# Altium schematic sheet Power.SchDoc
size 420 x 297 mm; SheetNumber: 1; SheetTotal: 3
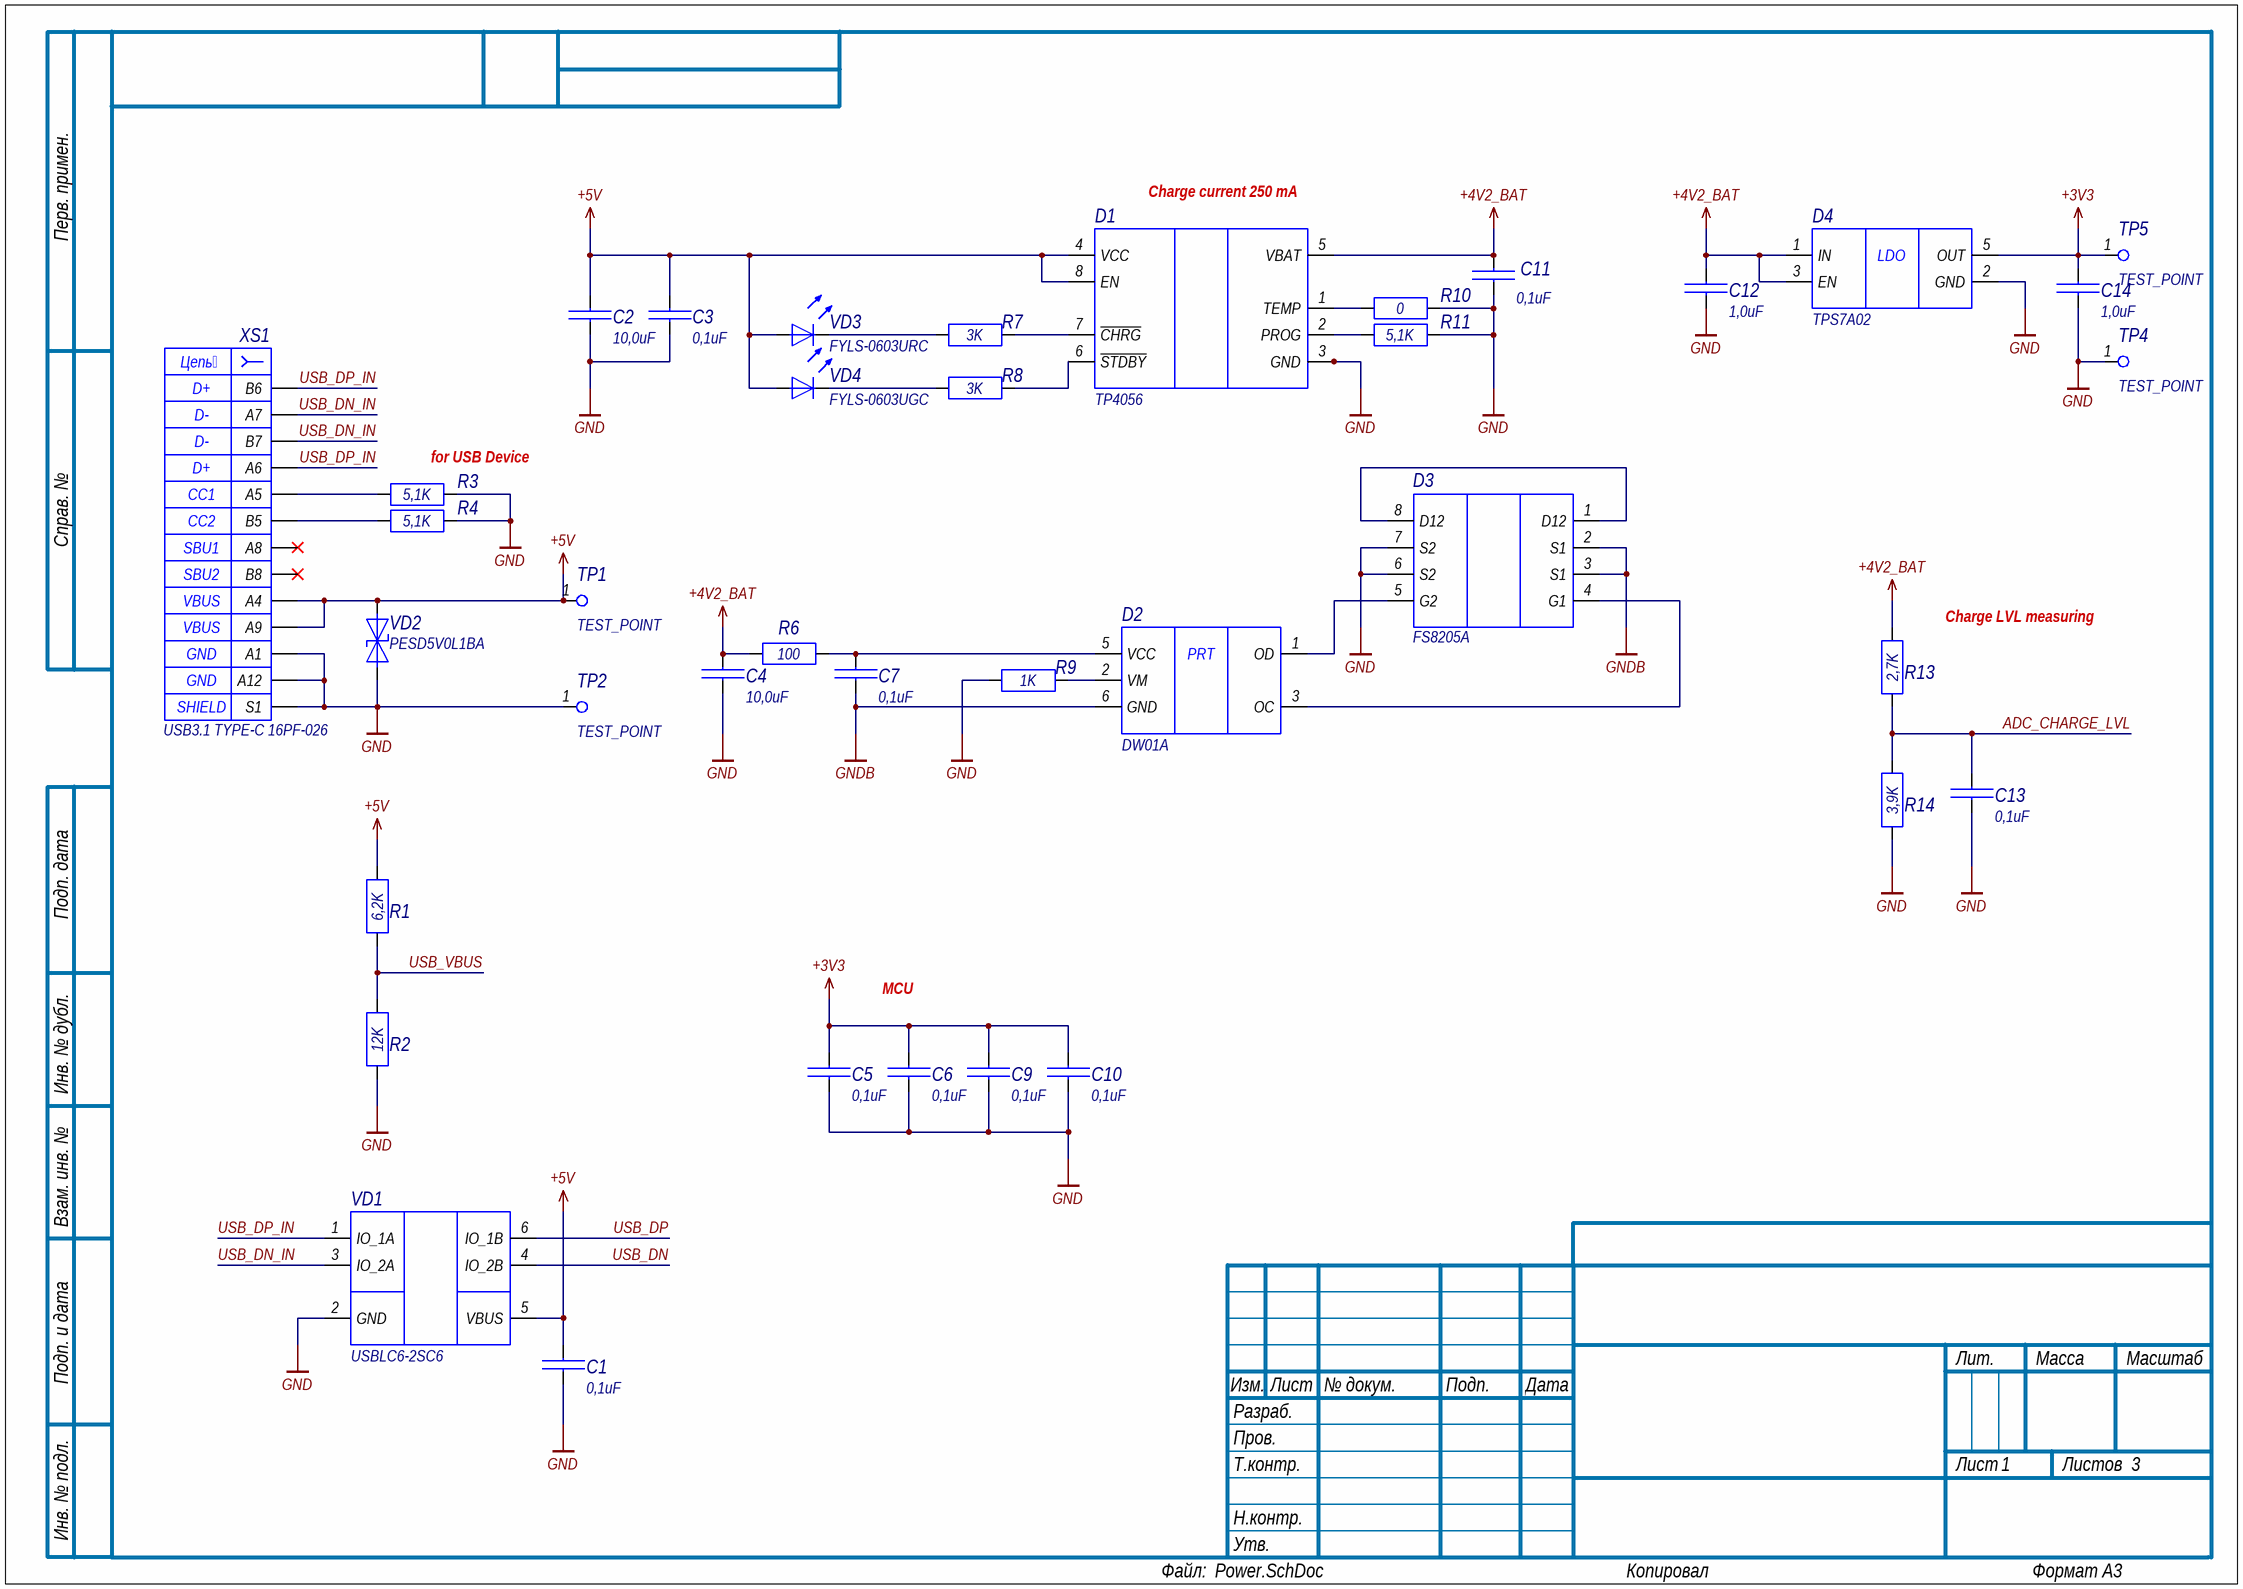
[diagram p0: Power.SchDoc]

## Parts
C1  value 0,1uF  [CAP_0603]  (hidden comment: CAPACITOR)
C2  value 10,0uF  [CAP_0603]  (hidden comment: CAPACITOR)
C3  value 0,1uF  [CAP_0603]  (hidden comment: CAPACITOR)
C4  value 10,0uF  [CAP_0603]  (hidden comment: CAPACITOR)
C5  value 0,1uF  [CAP_0603]  (hidden comment: CAPACITOR)
C6  value 0,1uF  [CAP_0603]  (hidden comment: CAPACITOR)
C7  value 0,1uF  [CAP_0603]  (hidden comment: CAPACITOR)
C9  value 0,1uF  [CAP_0603]  (hidden comment: CAPACITOR)
C10  value 0,1uF  [CAP_0603]  (hidden comment: CAPACITOR)
C11  value 0,1uF  [CAP_0603]  (hidden comment: CAPACITOR)
C12  value 1,0uF  [CAP_0603]  (hidden comment: CAPACITOR)
C13  value 0,1uF  [CAP_0603]  (hidden comment: CAPACITOR)
C14  value 1,0uF  [CAP_0603]  (hidden comment: CAPACITOR)
D1  TP4056  [ESOP-8]
D2  DW01A  [SOT-23-6]
D3  FS8205A  [TSSOP-8]
D4  TPS7A02  [SOT-23-5]
R1  value 6,2K  [RES_0603]  (hidden comment: RESISTOR)
R2  value 12K  [RES_0603]  (hidden comment: RESISTOR)
R3  value 5,1K  [RES_0603]  (hidden comment: RESISTOR)
R4  value 5,1K  [RES_0603]  (hidden comment: RESISTOR)
R6  value 100  [RES_0603]  (hidden comment: RESISTOR)
R7  value 3K  [RES_0603]  (hidden comment: RESISTOR)
R8  value 3K  [RES_0603]  (hidden comment: RESISTOR)
R9  value 1K  [RES_0603]  (hidden comment: RESISTOR)
R10  value 0  [RES_0603]  (hidden comment: RESISTOR)
R11  value 5,1K  [RES_0603]  (hidden comment: RESISTOR)
R13  value 2,7K  [RES_0603]  (hidden comment: RESISTOR)
R14  value 3,9K  [RES_0603]  (hidden comment: RESISTOR)
TP1  TEST_POINT  [TP-SMD-R0.9x0.85]  (no BOM)
TP2  TEST_POINT  [TP-SMD-R0.9x0.85]  (no BOM)
TP4  TEST_POINT  [TP-SMD-R0.9x0.85]  (no BOM)
TP5  TEST_POINT  [TP-SMD-R0.9x0.85]  (no BOM)
VD1  USBLC6-2SC6  [SOT-23-6]
VD2  value PESD5V0L1BA  [SOD-323F-NO-CATHODE]  (hidden comment: ZENER BIDIR)
VD3  value FYLS-0603URC  [LED_0603_R]  (hidden comment: LED)
VD4  value FYLS-0603UGC  [LED_0603_G]  (hidden comment: LED)
XS1  value USB3.1 TYPE-C 16PF-026  [USB3.1TYPE-C 16PF-26]  (hidden comment: USB3.1TYPE-C 16PF-26)

## Nets
+3V3: C5.1 C6.1 C9.1 C10.1 C14.2 D4.5(OUT) TP5.1
+4V2_BAT: C4.1 C11.1 C12.2 D1.5(VBAT) D4.1(IN) D4.3(EN) R6.1 R13.2
+5V: C1.1 C2.1 C3.1 D1.4(VCC) D1.8(EN) R1.2 TP1.1 VD1.5(VBUS) VD2.1 VD3.A VD4.A XS1.A4 XS1.A9
GND: C1.2 C2.2 C3.2 C4.2 C5.2 C6.2 C9.2 C10.2 C11.2 C12.1 C13.2 C14.1 D1.0(EPAD) D1.3(GND) D3.6(S2) D3.7(S2) D4.2(GND) R2.1 R3.2 R4.2 R9.1 R10.2 R11.2 R14.1 TP2.1 TP4.1 VD1.2(GND) VD2.2 XS1.A1 XS1.A12 XS1.S1
GNDB: C7.2 D2.6(GND) D3.2(S1) D3.3(S1)
ADC_CHARGE_LVL: C13.1 R13.1 R14.2
USB_DN: VD1.4(IO_2B)
USB_DN_IN: VD1.3(IO_2A) XS1.A7 XS1.B7
USB_DP: VD1.6(IO_1B)
USB_DP_IN: VD1.1(IO_1A) XS1.A6 XS1.B6
USB_VBUS: R1.1 R2.2
NetC7_1: C7.1 D2.5(VCC) R6.2
NetD1_1: D1.1(TEMP) R10.1
NetD1_2: D1.2(PROG) R11.1
NetD1_6: D1.6(~{STDBY}) R8.2
NetD1_7: D1.7(~{CHRG}) R7.2
NetD2_1: D2.1(OD) D3.5(G2)
NetD2_2: D2.2(VM) R9.2
NetD2_3: D2.3(OC) D3.4(G1)
NetD3_1: D3.1(D12) D3.8(D12)
NetR3_1: R3.1 XS1.A5
NetR4_1: R4.1 XS1.B5
NetR7_1: R7.1 VD3.K
NetR8_1: R8.1 VD4.K

Not connected (* = marked no-connect by the designer): XS1 A8* B8*

## Notes on the sheet
- (near D1) Charge current 250 mA
- (near R3) for USB Device
- Charge LVL measuring
- MCU
- Перв. примен.
- Справ. №
- Подп. дата
- Инв. № дубл.
- Взам. инв. №
- Подп. и дата
- Изм.
- Разраб.
- Лист
- № докум.
- Подп.
- Дата
- Лит.
- Масса
- Масштаб
- Пров.
- Т.контр.
- Листов
- Инв. № подл.
- Н.контр.
- Утв.
- Файл:
- Копировал
- Формат А3
- (in symbol DW01A) PRT
- (in symbol USB3.1 TYPE-C 16PF-026) Цепь; D+; D-; CC1; CC2; SBU1; SBU2; VBUS; GND; SHIELD

## Library data of the parts
C1 C3 C5-C7 C9-C11 C13 = CAP_CER_0603_104_25_10_X7R: Ceramic Capacitor SMD_0603 X7R; Manufacturer: Yageo; Manufacturer Part Number: CC0603KRX7R8BB104; Voltage: 25V; Tolerance: 10%; Part Number: CAP_CER_0603_104_25_10_X7R; Part Type: 0603; Size: 0603; Dielectric: X7R
C2 = CAP_CER_0603_106_25_10_X5R: Ceramic Capacitor SMD_0603 X5R; Manufacturer: Yageo; Manufacturer Part Number: CC0603KRX5R8BB106; Voltage: 25V; Tolerance: 10%; Replace: GRM188R61E106KA73D; Part Number: CAP_CER_0603_106_25_10_X5R; Part Type: 0603; Size: 0603; Dielectric: X5R
C4 = CAP_CER_0603_106_10_10_X5R: Ceramic Capacitor SMD_0603 X5R; Manufacturer: Yageo; Manufacturer Part Number: CC0603KRX5R6BB106; Voltage: 10V; Tolerance: 10%; Part Number: CAP_CER_0603_106_10_10_X5R; Part Type: 0603; Size: 0603; Dielectric: X5R
C12 C14 = CAP_CER_0603_105_25_10_X5R: Ceramic Capacitor SMD_0603 X5R; Manufacturer: Yageo; Manufacturer Part Number: CC0603KRX5R8BB105; Voltage: 25V; Tolerance: 10%; Part Number: CAP_CER_0603_105_25_10_X5R; Part Type: 0603; Size: 0603; Dielectric: X5R
D1 = TP4056: 1A Standalone Linear Li-Ion Battery Charger; Manufacturer: UMW; Value: TP4056; Part Number: TP4056; Part Type: POWER; Size: ESOP-8; Manufacturer Part Number: TP4056
D2 = DW01A: The DW01A battery protection IC is designed to / protect lithium-ion/polymer battery from damage or / degrading the lifetime due to overcharge, / overdischarge, and/or overcurrent for one-cell / lithium-ion/polymer battery powered systems, such as / cellular phones; Value: DW01A; Part Number: DW01A; Part Type: POWER; Size: SOT-23-6; Manufacturer: -; Manufacturer Part Number: DW01A
D3 = FS8205A: Dual N-Channel Enhancement Mode Power MOSFET; Manufacturer: Tech Public; Value: FS8205A; Part Number: FS8205A; Part Type: POWER; Size: TSSOP-8; Manufacturer Part Number: FS8205A
D4 = TPS7A02: TPS7A02 Nanopower IQ, 25-nA, 200-mA, Low-Dropout Voltage Regulator With Fast / Transient Response; Manufacturer: Texas Instruments; Manufacturer Part Number: TPS7A0236PDBVR; Value: TPS7A02; Part Number: TPS7A02; Part Type: LDO; Size: SOT-23-5
R1 = RES_SMD_0603_6K2_5%: Resistor fixed SMD_0603 5%; Manufacturer: Yageo; Manufacturer Part Number: RC0603JR-076K2L; Power: 100mW; Part Number: RES_SMD_0603_6K2_5%; Part Type: 0603; Tolerance: 5%; Size: 0603
R2 = RES_SMD_0603_12K_1%: Resistor fixed SMD_0603 1%; Manufacturer: Yageo; Manufacturer Part Number: RC0603FR-0712KL; Power: 100mW; Part Number: RES_SMD_0603_12K_1%; Part Type: 0603; Tolerance: 1%; Size: 0603
R3 R4 R11 = RES_SMD_0603_5K1_5%: Resistor fixed SMD_0603 5%; Manufacturer: Yageo; Manufacturer Part Number: RC0603JR-075K1L; Power: 100mW; Part Number: RES_SMD_0603_5K1_5%; Part Type: 0603; Tolerance: 5%; Size: 0603
R6 = RES_SMD_0603_100R_5%: Resistor fixed SMD_0603 5%; Manufacturer: Yageo; Manufacturer Part Number: RC0603JR-07100RL; Power: 100mW; Part Number: RES_SMD_0603_100R_5%; Part Type: 0603; Tolerance: 5%; Size: 0603
R7 R8 = RES_SMD_0603_3K_5%: Resistor fixed SMD_0603 5%; Manufacturer: Yageo; Manufacturer Part Number: RC0603JR-073KL; Power: 100mW; Part Number: RES_SMD_0603_3K_5%; Part Type: 0603; Tolerance: 5%; Size: 0603
R9 = RES_SMD_0603_1K_5%: Resistor fixed SMD_0603 5%; Manufacturer: Yageo; Manufacturer Part Number: RC0603JR-071KL; Power: 100mW; Part Number: RES_SMD_0603_1K_5%; Part Type: 0603; Tolerance: 5%; Size: 0603
R10 = RES_SMD_0603_0R_5%: Resistor fixed SMD_0603 5%; Manufacturer: Yageo; Manufacturer Part Number: RC0603JR-070RL; Power: 100mW; Part Number: RES_SMD_0603_0R_5%; Part Type: 0603; Tolerance: 5%; Size: 0603
R13 = RES_SMD_0603_2K7_5%: Resistor fixed SMD_0603 5%; Manufacturer: Yageo; Manufacturer Part Number: RC0603JR-072K7L; Power: 100mW; Part Number: RES_SMD_0603_2K7_5%; Part Type: 0603; Tolerance: 5%; Size: 0603
R14 = RES_SMD_0603_3K9_5%: Resistor fixed SMD_0603 5%; Manufacturer: Yageo; Manufacturer Part Number: RC0603JR-073K9L; Power: 100mW; Part Number: RES_SMD_0603_3K9_5%; Part Type: 0603; Tolerance: 5%; Size: 0603
TP1 TP2 TP4 TP5 = TP-SMD-R0.9x0.85: Test Point, SMP Pad, 0.9x0.85mm; Value: TP; Part Number: TP-SMD-R0.9x0.85; Part Type: TP-SMD-R0.9x0.85
VD1 = USBLC6-2SC6: Low Capacitance 2-Line ESD Protection for USB Protection; Manufacturer: UMW; Voltage: 5V; Replace: USBLC6-2SC6 (STM); Value: USBLC6-2SC6; Part Number: USBLC6-2SC6; Part Type: ESD; Size: SOT-23-6; Manufacturer Part Number: USBLC6-2SC6
VD2 = PESD5V0L1BA: Low Capacitance Bidirectional ESD Protection Diode; Manufacturer: UMW; Voltage: 5V; Part Number: PESD5V0L1BA; Part Type: ESD; Size: SOD-323; Manufacturer Part Number: PESD5V0L1BA
VD3 = FYLS-0603URC: SMD 0603 LED Red; Manufacturer: Foryard; Part Number: FYLS-0603URC; Part Type: LED; Size: 0603; Manufacturer Part Number: FYLS-0603URC
VD4 = FYLS-0603UGC: SMD 0603 LED Green; Manufacturer: Foryard; Replace: BL-HGE36G-AV-TR8; Part Number: FYLS-0603UGC; Part Type: LED; Size: 0603; Manufacturer Part Number: FYLS-0603UGC
XS1 = USB3.1 TYPE-C 16PF-026: USB3.1 as USB2.0. Original: USB4110-GF_A; Manufacturer: RUICHI; Manufacturer Part Number: RUICHI USB3.1 TYPE-C; Replace: USB4110-GF-A (GCT); Part Number: USB3.1 TYPE-C 16PF-026; Part Type: PC